# Altium project PCB_Project.PrjPcb (part 3 of 5)
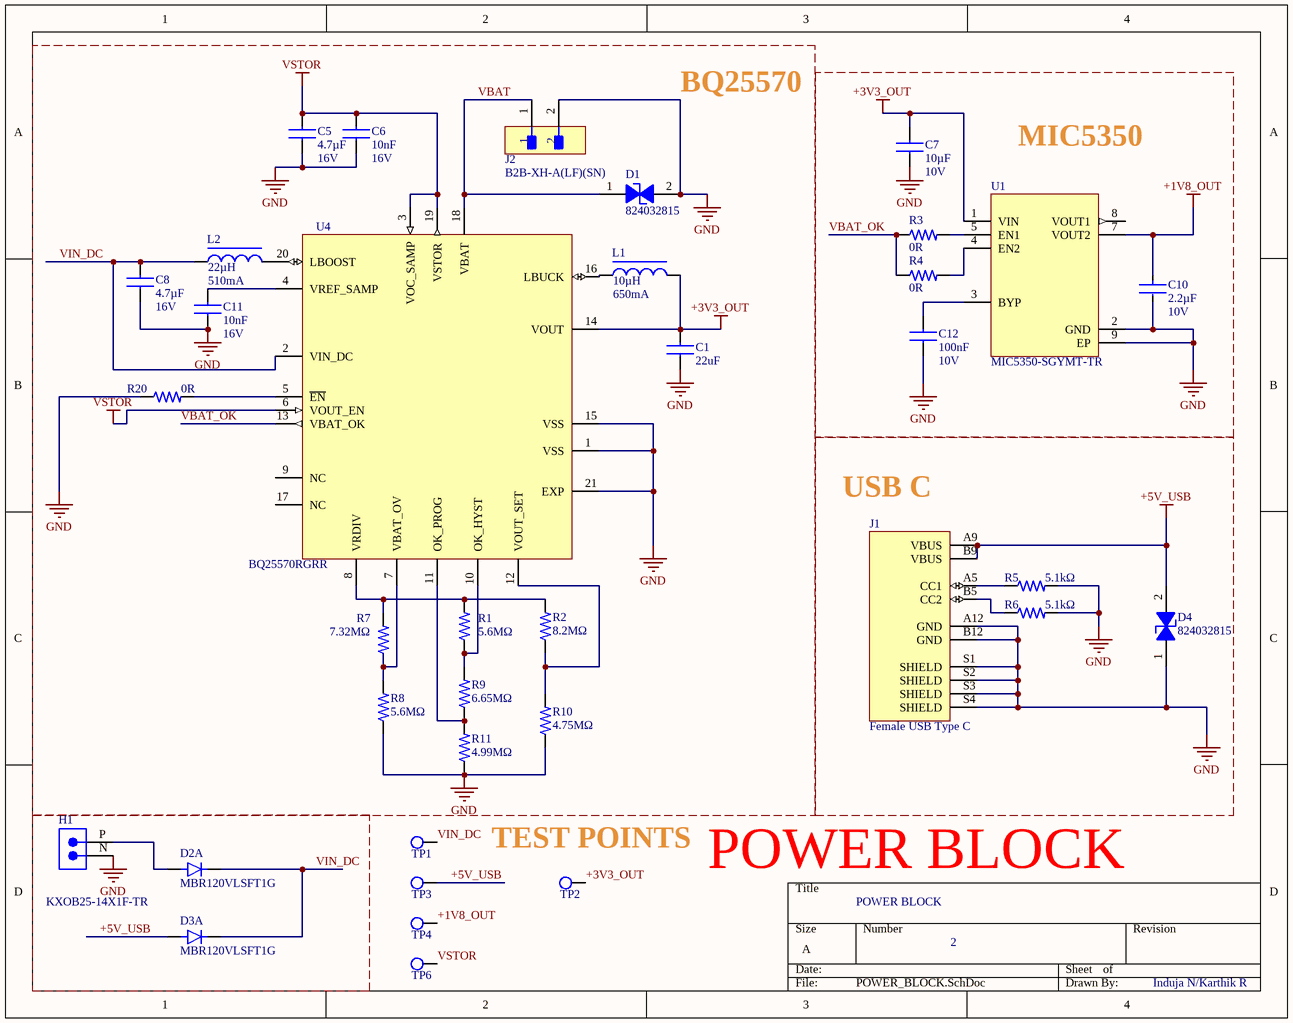
[diagram p8: POWER_BLOCK.SchDoc]

## Sheet POWER_BLOCK.SchDoc (continued)

### Library data of the parts (continued)
R11 = RES 4.99M 0603: Fixed Resistor, Metal Glaze/thick Film, 0.1W, 4990000ohm, 75V, 1% +/-Tol, 100ppm/Cel, Surface Mount, 0603; Manufacturer: Yageo; Manufacturer Part Number: RC0603FR-074M99L; Additional Feature: LASER TRIMMABLE; Power: 100mW; Rated Temperature: 70°C; Temperature Coefficient: 100ppm/°C; Package Height: 0.45mm; Package Length: 1.6mm; Package Width: 0.8mm; Supplier: Digikey; Supplier Part Number: 13-RC0603FR-074M99LDKR-ND; RoHS: Yes; Category: Chip SMD Resistors; Stock: 585; Pricing: 1=0.1, 10=0.019, 50=0.0112, 100=0.0093, 500=0.00622, 1000=0.00532 (USD); Mounting Technology: Surface Mount; Pins: 2; Package Shape: Rectangular; Case/Package: 0603; Terminal Finish: Nickel; Min Operating Temperature: -55°C; Max Operating Temperature: 155°C; Tolerance: 1%; JESD-609 Code: e3; Resistor Type: FIXED RESISTOR; Construction: Chip; Package Style: SMTMeter; Packaging: Tape and Reel; Technology: METAL GLAZE/THICK FILM; Termination: Wraparound; Working Voltage: 75V; Reach SVHC Compliant: Yes; RoHS Compliant: Yes; ComponentLink1URL: https://datasheet.ciiva.com:443/pdfs/VipMasterIC/IC/YAGO/YAGO-S-A0008145938/YAGO-S-A0008145938-1.pdf?src-supplier=IHS+Markit; ComponentLink1Description: https://datasheet.ciiva.com:443/pdfs/VipMasterIC/IC/YAGO/YAGO-S-A0008145938/YAGO-S-A0008145938-1.pdf?src-supplier=IHS+Markit; ComponentLink2URL: http://www.mouser.com/ds/2/447/RC0603-272842.pdf?src-supplier=Mouser; ComponentLink2Description: http://www.mouser.com/ds/2/447/RC0603-272842.pdf?src-supplier=Mouser; ComponentLink3URL: http://www.yageo.com/documents/recent/PYu-RC_Group_51_RoHS_L_9.pdf?src-supplier=Digikey; ComponentLink3Description: http://www.yageo.com/documents/recent/PYu-RC_Group_51_RoHS_L_9.pdf?src-supplier=Digikey; ComponentLink4URL: http://www.yageo.com/documents/recent/PYu-RC0603_51_RoHS_L_7.pdf?src-supplier=Future+Electronics; ComponentLink4Description: http://www.yageo.com/documents/recent/PYu-RC0603_51_RoHS_L_7.pdf?src-supplier=Future+Electronics; ComponentLink5URL: http://www.yageo.com/documents/recent/PYu-RC_Group_51_RoHS_L_2.pdf?src-supplier=Avnet; ComponentLink5Description: http://www.yageo.com/documents/recent/PYu-RC_Group_51_RoHS_L_2.pdf?src-supplier=Avnet; ComponentLink6URL: https://datasheet.octopart.com/RC0603FR-074M99L-Yageo-datasheet-164759695.pdf?src-supplier=Future+Electronics; ComponentLink6Description: https://datasheet.octopart.com/RC0603FR-074M99L-Yageo-datasheet-164759695.pdf?src-supplier=Future+Electronics; ComponentLink7URL: https://datasheet.octopart.com/RC0603FR-074M99L-Yageo-datasheet-148775077.pdf?src-supplier=TME; ComponentLink7Description: https://datasheet.octopart.com/RC0603FR-074M99L-Yageo-datasheet-148775077.pdf?src-supplier=TME; Supplier 1: DigiKey; Supplier Part Number 1: 13-RC0603FR-074M99LCT-ND
U1 = MIC5350-SGYMT-TR: Linear Voltage Regulator IC Positive Fixed 2 Output 300mA, 500mA 8-TMLFÂ® (2x2); MF: Microchip; SnapEDA_Link: https://www.snapeda.com/parts/MIC5350-SGYMT-TR/Microchip/view-part/?ref=snap; Package: UFDFN-8 Microchip; Value: *; MP: MIC5350-SGYMT-TR; Check_prices: https://www.snapeda.com/parts/MIC5350-SGYMT-TR/Microchip/view-part/?ref=eda; Supplier 1: DigiKey; Supplier Part Number 1: 576-3674-1-ND
U4 = BQ25570RGRR: Ultra Low power Harvester power Management IC with boost charger, and Nanopower Buck Converter; MF: Texas Instruments; Package: VQFN-20 Texas Instruments; Value: *; Purchase-URL: https://pricing.snapeda.com/search/part/BQ25570RGRR/?ref=eda; Availability: In Stock; MP: BQ25570RGRR; Check_prices: https://www.snapeda.com/parts/BQ25570RGRR/Texas+Instruments/view-part/?ref=eda; SnapEDA_Link: https://www.snapeda.com/parts/BQ25570RGRR/Texas+Instruments/view-part/?ref=snap; Price: None; Supplier 1: DigiKey; Supplier Part Number 1: 296-39934-1-ND

## Sheet HEART_RATE.SchDoc
size A4; Author: Induja N/Karthik R; SheetNumber: 3; SheetTotal: 7
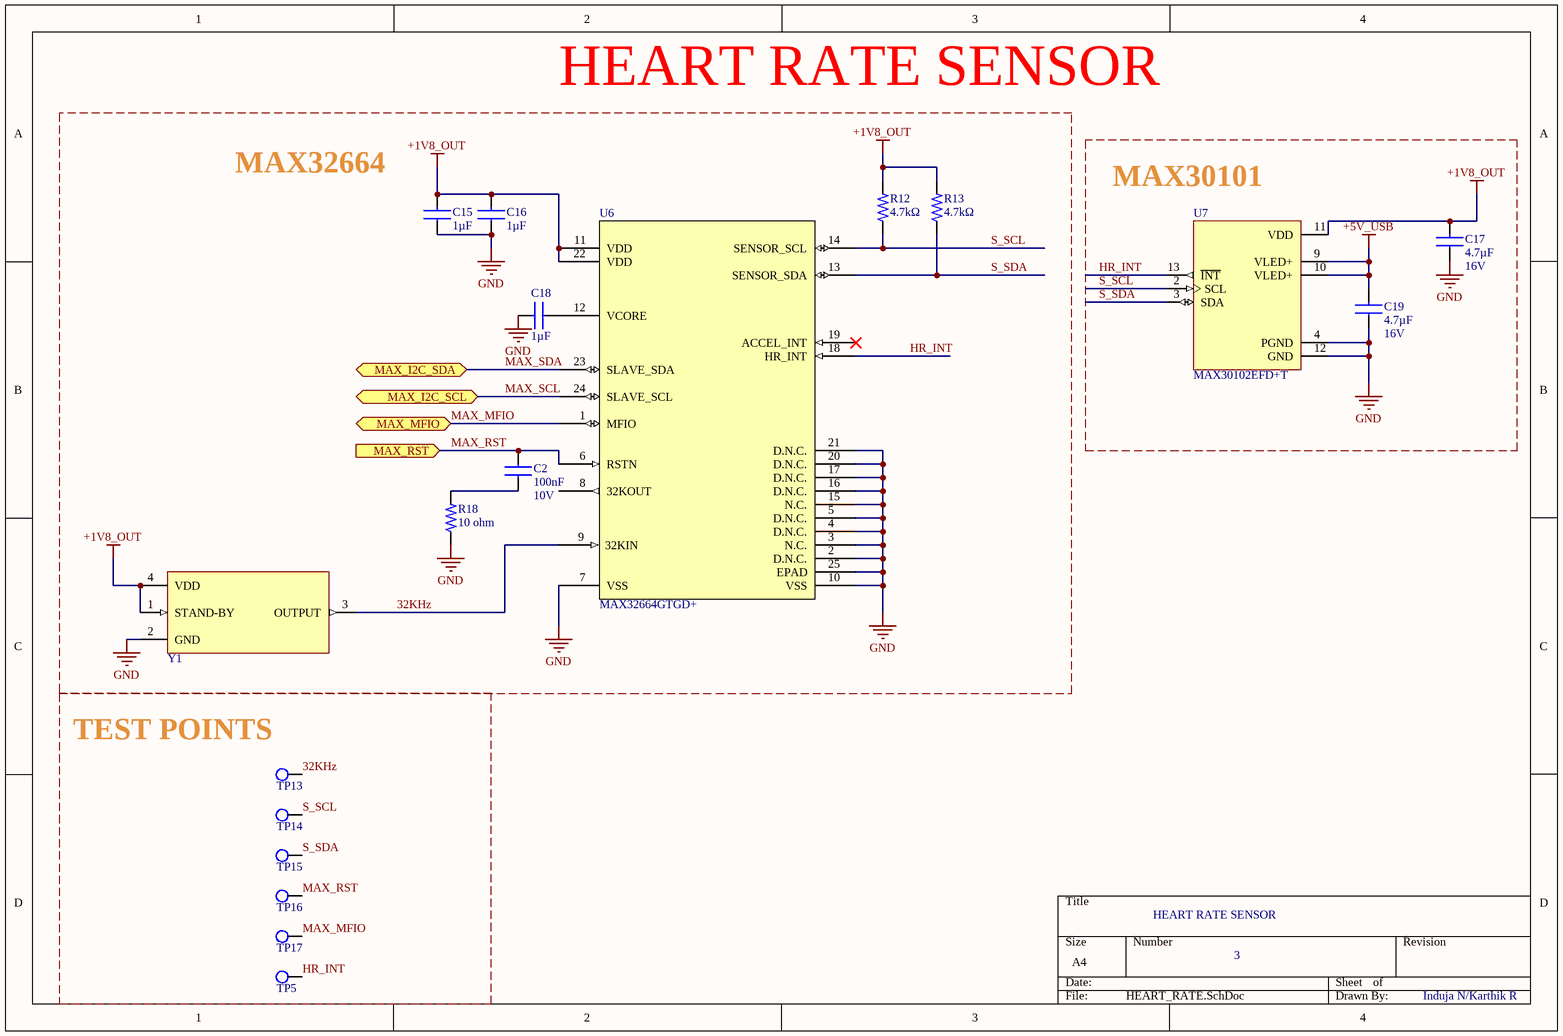
[diagram p2: HEART_RATE.SchDoc]

### Parts
C2  value 100nF  Voltage Rating (DC): 10V  [CAP_0603_1MM]  (hidden comment: CAP 0.1uF 0603)
C15  value 1µF  [Capacitor 0603]
C16  value 1µF  [Capacitor 0603]
C17  value 4.7µF  Voltage Rating (DC): 16V  [Capacitor 0603]  (hidden comment: GRM188Z71C475KE21D)
C18  value 1µF  [Capacitor 0603]
C19  value 4.7µF  Voltage Rating (DC): 16V  [Capacitor 0603]  (hidden comment: GRM188Z71C475KE21D)
R12  value 4.7kΩ  [RES_0603_1608X06]  (hidden comment: RES 4.7K 0603)
R13  value 4.7kΩ  [RES_0603_1608X06]  (hidden comment: RES 4.7K 0603)
R18  10 ohm  [RES_0603_1608X06]
TP5  Test Point  [Test Point]  (value not drawn)  (net tie, no BOM)
TP13  Test Point  [Test Point]  (value not drawn)  (net tie, no BOM)
TP14  Test Point  [Test Point]  (value not drawn)  (net tie, no BOM)
TP15  Test Point  [Test Point]  (value not drawn)  (net tie, no BOM)
TP16  Test Point  [Test Point]  (value not drawn)  (net tie, no BOM)
TP17  Test Point  [Test Point]  (value not drawn)  (net tie, no BOM)
U6  MAX32664GTGD+  [21-100264_T2433+2C_MXM]
U7  MAX30102EFD+T  [XDCR_MAX30101EFD+]
Y1  ECS-327MV-DM-TR  [OSC_ECS-327MV-DM-TR-4]  (value not drawn)

### Blocks framed on the sheet
HEART RATE SENSOR: C2 C15 C16 C18 R12 R13 R18 U6 Y1
MAX30101: C17 C19 U7
TEST POINTS: TP5 TP13-TP17

### Ports
MAX_I2C_SCL (bidir, see COMMUNICATION[3B]), MAX_I2C_SDA (bidir, see COMMUNICATION[3B]), MAX_MFIO (bidir, see EFR32BG13_INTERCONNECTS[3C]), MAX_RST (in, see EFR32BG13_INTERCONNECTS[3B])

### Nets
+1V8_OUT: C15.1 C16.1 C17.1 R12.2 R13.2 U6.11(VDD) U6.22(VDD) U7.11(VDD) Y1.1(STAND-BY) Y1.4(VDD)
+5V_USB: C19.1 U7.9(VLED+) U7.10(VLED+)
GND: C15.2 C16.2 C17.2 C18.2 C19.2 R18.1 U6.2(D.N.C.) U6.3(N.C.) U6.4(D.N.C.) U6.5(D.N.C.) U6.7(VSS) U6.10(VSS) U6.15(N.C.) U6.16(D.N.C.) U6.17(D.N.C.) U6.20(D.N.C.) U6.21(D.N.C.) U6.25(EPAD) U7.4(PGND) U7.12(GND) Y1.2(GND)
32KHz: TP13.1 U6.9(32KIN) Y1.3(OUTPUT)
HR_INT: TP5.1 U6.18(HR_INT) U7.13(~{INT})
MAX_MFIO: TP17.1 U6.1(MFIO) ; port MAX_MFIO
MAX_RST: C2.1 TP16.1 U6.6(RSTN) ; port MAX_RST
MAX_SCL: U6.24(SLAVE_SCL) ; port MAX_I2C_SCL
MAX_SDA: U6.23(SLAVE_SDA) ; port MAX_I2C_SDA
S_SCL: R12.1 TP14.1 U6.14(SENSOR_SCL) U7.2(SCL)
S_SDA: R13.1 TP15.1 U6.13(SENSOR_SDA) U7.3(SDA)
NetC2_2: C2.2 R18.2
NetC18_1: C18.1 U6.12(VCORE)

Not connected (* = marked no-connect by the designer): U6 8(32KOUT) 19(ACCEL_INT)*

### Notes on the sheet
- MAX32664
- HEART RATE SENSOR

### Library data of the parts
C2 = CAP 0.1uF 0603: 0603 0.1 uF 10 V ±10% Tolerance X7R SMT Multilayer Ceramic Chip Capacitor; Manufacturer: Vishay; Manufacturer Part Number: VJ0603Y104KXQCW1BC; Supplier: Newark; Supplier Part Number: 77AK2911; RoHS: Compliant; Category: Ceramic Capacitors; Stock: 20000; Pricing: 4000=0.028, 8000=0.026 (USD); Case/Package: 0603; Case Code (Imperial): 0603; Case Code (Metric): 1608; China RoHS: Compliant; Depth: 800µm; Dielectric: X7R; Dielectric Material: Ceramic; Height: 870µm; Lead Free: Lead Free; Length: 1.6mm; Lifecycle Status: Production; Max Operating Temperature: 125°C; Min Operating Temperature: -55°C; Mounting Technology: Surface Mount; Number of Terminals: 2; REACH SVHC: Yes; Schedule B: 8532240020, 8532240020|8532240020|8532240020|8532240020|8532240020; Termination: SMD/SMT; Tolerance: 10%; Width: 800µm; ComponentLink1URL: https://datasheet.octopart.com:443/VJ0603Y104KXQCW1BC-Vishay-datasheet-182138897.pdf?src-supplier=IHS; ComponentLink1Description: https://datasheet.octopart.com:443/VJ0603Y104KXQCW1BC-Vishay-datasheet-182138897.pdf?src-supplier=IHS; ComponentLink2URL: https://datasheet.octopart.com:443/VJ0603Y104KXQCW1BC-Vishay-datasheet-182137611.pdf?src-supplier=IHS; ComponentLink2Description: https://datasheet.octopart.com:443/VJ0603Y104KXQCW1BC-Vishay-datasheet-182137611.pdf?src-supplier=IHS; ComponentLink3URL: https://datasheet.octopart.com:443/VJ0603Y104KXQCW1BC-Vishay-datasheet-79783898.pdf?src-supplier=Future+Electronics; ComponentLink3Description: https://datasheet.octopart.com:443/VJ0603Y104KXQCW1BC-Vishay-datasheet-79783898.pdf?src-supplier=Future+Electronics; ComponentLink4URL: https://datasheet.octopart.com/VJ0603Y104KXQCW1BC-Vishay-datasheet-13530908.pdf; ComponentLink4Description: https://datasheet.octopart.com/VJ0603Y104KXQCW1BC-Vishay-datasheet-13530908.pdf; ComponentLink5URL: https://datasheet.octopart.com/VJ0603Y104KXQCW1BC-Vishay-datasheet-13436109.pdf; ComponentLink5Description: https://datasheet.octopart.com/VJ0603Y104KXQCW1BC-Vishay-datasheet-13436109.pdf; ComponentLink6URL: https://datasheet.octopart.com/VJ0603Y104KXQCW1BC-Vishay-datasheet-13168783.pdf; ComponentLink6Description: https://datasheet.octopart.com/VJ0603Y104KXQCW1BC-Vishay-datasheet-13168783.pdf; ComponentLink7URL: https://datasheet.octopart.com/VJ0603Y104KXQCW1BC-Vishay-datasheet-13134009.pdf; ComponentLink7Description: https://datasheet.octopart.com/VJ0603Y104KXQCW1BC-Vishay-datasheet-13134009.pdf; ComponentLink8URL: https://datasheet.octopart.com/VJ0603Y104KXQCW1BC-Vishay-datasheet-13055807.pdf; ComponentLink8Description: https://datasheet.octopart.com/VJ0603Y104KXQCW1BC-Vishay-datasheet-13055807.pdf; ComponentLink9URL: https://datasheet.octopart.com/VJ0603Y104KXQCW1BC-Vishay-datasheet-13029350.pdf; ComponentLink9Description: https://datasheet.octopart.com/VJ0603Y104KXQCW1BC-Vishay-datasheet-13029350.pdf; ComponentLink10URL: https://datasheet.octopart.com/VJ0603Y104KXQCW1BC-Vishay-datasheet-12584848.pdf; ComponentLink10Description: https://datasheet.octopart.com/VJ0603Y104KXQCW1BC-Vishay-datasheet-12584848.pdf; ComponentLink11URL: https://datasheet.octopart.com/VJ0603Y104KXQCW1BC-Vishay-datasheet-12543093.pdf; ComponentLink11Description: https://datasheet.octopart.com/VJ0603Y104KXQCW1BC-Vishay-datasheet-12543093.pdf; ComponentLink12URL: https://datasheet.octopart.com/VJ0603Y104KXQCW1BC-Vishay-datasheet-12532924.pdf; ComponentLink12Description: https://datasheet.octopart.com/VJ0603Y104KXQCW1BC-Vishay-datasheet-12532924.pdf; ComponentLink13URL: https://datasheet.octopart.com/VJ0603Y104KXQCW1BC-Vishay-datasheet-12519409.pdf; ComponentLink13Description: https://datasheet.octopart.com/VJ0603Y104KXQCW1BC-Vishay-datasheet-12519409.pdf; ComponentLink14URL: https://datasheet.octopart.com/VJ0603Y104KXQCW1BC-Vishay-datasheet-12509873.pdf; ComponentLink14Description: https://datasheet.octopart.com/VJ0603Y104KXQCW1BC-Vishay-datasheet-12509873.pdf; ComponentLink15URL: http://sigma.octopart.com:80/rohs_statement/Vishay-company-15.pdf?src-supplier=Compliance+Statements; ComponentLink15Description: http://sigma.octopart.com:80/rohs_statement/Vishay-company-15.pdf?src-supplier=Compliance+Statements; Supplier 1: DigiKey; Supplier Part Number 1: 720-1689-1-ND
C15 C16 C18 = CAP 1uF 0603: 16V 1uF X7R ±10% 0603 Multilayer Ceramic Capacitors MLCC - SMD/SMT ROHS; Manufacturer: Samsung Electro-Mechanics; Manufacturer Part Number: CL10B105KO8NNNC; Supplier: DigiKey; Supplier Part Number: 1276-1019-1-ND; RoHS: Compliant; Category: Ceramic Capacitors; Stock: 1501586; Pricing: 1=0.08, 10=0.011, 50=0.010, 100=0.0088 (USD); Case/Package: 0603; Case Code (Imperial): 0603; Case Code (Metric): 1608; China RoHS: Compliant; Depth: 800µm; Dielectric: X7R; Dielectric Material: Ceramic; Height: 800µm; Lead Free: Lead Free; Length: 1.6mm; Lifecycle Status: Production; Material: Ceramic; Max Operating Temperature: 125°C; Min Operating Temperature: -55°C; Mounting Technology: Surface Mount; Number of Terminals: 2; Radiation Hardening: No; REACH SVHC: Yes; Schedule B: 8532240020, 8532240020|8532240020, 8532240020|8532240020|8532240020, 8532240020|8532240020|8532240020|8532240020; Thickness: 889µm; Tolerance: 10%; Voltage: 16V; Voltage Rating: 16V; Voltage Rating (DC): 16V; Width: 800µm; ComponentLink1URL: https://datasheet.octopart.com:443/CL10B105KO8NNNC-Samsung-Electro-Mechanics-datasheet-137745070.pdf?src-supplier=IHS; ComponentLink1Description: https://datasheet.octopart.com:443/CL10B105KO8NNNC-Samsung-Electro-Mechanics-datasheet-137745070.pdf?src-supplier=IHS; ComponentLink2URL: https://datasheet.octopart.com/CL10B105KO8NNNC-Samsung-Electro-Mechanics-datasheet-8324245.pdf; ComponentLink2Description: https://datasheet.octopart.com/CL10B105KO8NNNC-Samsung-Electro-Mechanics-datasheet-8324245.pdf; ComponentLink3URL: https://datasheet.octopart.com/CL10B105KO8NNNC-Samsung-Electro-Mechanics-datasheet-97040617.pdf; ComponentLink3Description: https://datasheet.octopart.com/CL10B105KO8NNNC-Samsung-Electro-Mechanics-datasheet-97040617.pdf; ComponentLink4URL: https://datasheet.octopart.com/General-Multilayer-Ceramic-Capacitors-Samsung-datasheet-family-111.pdf; ComponentLink4Description: https://datasheet.octopart.com/General-Multilayer-Ceramic-Capacitors-Samsung-datasheet-family-111.pdf; ComponentLink5URL: https://datasheet.octopart.com:443/CL10B105KO8NNNC-Samsung-Electro-Mechanics-datasheet-116890984.pdf?src-supplier=Future+Electronics; ComponentLink5Description: https://datasheet.octopart.com:443/CL10B105KO8NNNC-Samsung-Electro-Mechanics-datasheet-116890984.pdf?src-supplier=Future+Electronics; ComponentLink6URL: https://datasheet.octopart.com:443/CL10B105KO8NNNC-Samsung-Electro-Mechanics-datasheet-81461852.pdf?src-supplier=Future+Electronics; ComponentLink6Description: https://datasheet.octopart.com:443/CL10B105KO8NNNC-Samsung-Electro-Mechanics-datasheet-81461852.pdf?src-supplier=Future+Electronics; ComponentLink7URL: https://datasheet.octopart.com:443/CL10B105KO8NNNC-Samsung-datasheet-42770397.pdf?src-supplier=Future+Electronics; ComponentLink7Description: https://datasheet.octopart.com:443/CL10B105KO8NNNC-Samsung-datasheet-42770397.pdf?src-supplier=Future+Electronics; ComponentLink8URL: https://datasheet.octopart.com:443/CL10B105KO8NNNC-Samsung-datasheet-26669023.pdf?src-supplier=Future+Electronics; ComponentLink8Description: https://datasheet.octopart.com:443/CL10B105KO8NNNC-Samsung-datasheet-26669023.pdf?src-supplier=Future+Electronics; ComponentLink9URL: https://datasheet.octopart.com:443/CL10B105KO8NNNC-Samsung-Electro-Mechanics-datasheet-149136799.pdf?src-supplier=Future+Electronics; ComponentLink9Description: https://datasheet.octopart.com:443/CL10B105KO8NNNC-Samsung-Electro-Mechanics-datasheet-149136799.pdf?src-supplier=Future+Electronics; ComponentLink10URL: https://datasheet.octopart.com:443/CL10B105KO8NNNC-Samsung-datasheet-151956584.pdf?src-supplier=SOS+electronic; ComponentLink10Description: https://datasheet.octopart.com:443/CL10B105KO8NNNC-Samsung-datasheet-151956584.pdf?src-supplier=SOS+electronic; ComponentLink11URL: https://datasheet.octopart.com:443/CL10B105KO8NNNC-Samsung-Electro-Mechanics-datasheet-11774093.pdf?src-supplier=Arrow+Electronics; ComponentLink11Description: https://datasheet.octopart.com:443/CL10B105KO8NNNC-Samsung-Electro-Mechanics-datasheet-11774093.pdf?src-supplier=Arrow+Electronics; ComponentLink12URL: https://datasheet.octopart.com:443/CL10B105KO8NNNC-Samsung-datasheet-59220082.pdf?src-supplier=TME; ComponentLink12Description: https://datasheet.octopart.com:443/CL10B105KO8NNNC-Samsung-datasheet-59220082.pdf?src-supplier=TME; ComponentLink13URL: http://sigma.octopart.com:80/rohs_certificate/General-Multilayer-Ceramic-Capacitors-Samsung-family-110.pdf?src-supplier=Compliance+Statements; ComponentLink13Description: http://sigma.octopart.com:80/rohs_certificate/General-Multilayer-Ceramic-Capacitors-Samsung-family-110.pdf?src-supplier=Compliance+Statements; ComponentLink14URL: http://sigma.octopart.com:80/rohs_statement/General-Multilayer-Ceramic-Capacitors-Samsung-family-132.pdf?src-supplier=Compliance+Statements; ComponentLink14Description: http://sigma.octopart.com:80/rohs_statement/General-Multilayer-Ceramic-Capacitors-Samsung-family-132.pdf?src-supplier=Compliance+Statements; ComponentLink15URL: http://sigma.octopart.com:80/reach_statement/General-Multilayer-Ceramic-Capacitors-Samsung-family-133.pdf?src-supplier=Compliance+Statements; ComponentLink15Description: http://sigma.octopart.com:80/reach_statement/General-Multilayer-Ceramic-Capacitors-Samsung-family-133.pdf?src-supplier=Compliance+Statements; Supplier 1: DigiKey; Supplier Part Number 1: 1276-1019-1-ND
C17 C19 = CAP 4.7uF 16V X7R: 16V 4.7uF X7R ±10% 0603 Multilayer Ceramic Capacitors MLCC - SMD/SMT ROHS; Manufacturer: Murata; Manufacturer Lifecycle Status: IN PRODUCTION; Supplier: Newark; Supplier Part Number: 64AJ4376; Manufacturer Part Number: GRM188Z71C475KE21D; RoHS: Compliant; Category: Ceramic Capacitors; Stock: 28269; Pricing: 10=0.105, 25=0.097, 50=0.089, 100=0.081, 250=0.078, 500=0.074, 1000=0.067 (USD); Case/Package: 0603; Dielectric Material: Ceramic; Height: 800µm; Length: 1.6mm; Lifecycle Status: Production; Material: Ceramic; Max Operating Temperature: 125°C; Min Operating Temperature: -55°C; Mounting Technology: Surface Mount; Number of Terminals: 2; REACH SVHC: Yes; Thickness: 800µm; Tolerance: 10%; Voltage Rating: 16V; Width: 800µm; ComponentLink1URL: https://datasheet.octopart.com:443/GRM188Z71C475KE21D-Murata-datasheet-141276020.pdf?src-supplier=Geoflip; ComponentLink1Description: https://datasheet.octopart.com:443/GRM188Z71C475KE21D-Murata-datasheet-141276020.pdf?src-supplier=Geoflip; ComponentLink2URL: https://datasheet.octopart.com:443/GRM188Z71C475KE21D-Murata-datasheet-165579666.pdf?src-supplier=TME; ComponentLink2Description: https://datasheet.octopart.com:443/GRM188Z71C475KE21D-Murata-datasheet-165579666.pdf?src-supplier=TME; ComponentLink3URL: https://datasheet.octopart.com:443/GRM188Z71C475KE21D-Murata-datasheet-140705917.pdf?src-supplier=Ciiva; ComponentLink3Description: https://datasheet.octopart.com:443/GRM188Z71C475KE21D-Murata-datasheet-140705917.pdf?src-supplier=Ciiva; ComponentLink4URL: https://datasheet.octopart.com:443/GRM188Z71C475KE21D-Murata-datasheet-138743435.pdf?src-supplier=Ciiva; ComponentLink4Description: https://datasheet.octopart.com:443/GRM188Z71C475KE21D-Murata-datasheet-138743435.pdf?src-supplier=Ciiva; ComponentLink5URL: http://sigma.octopart.com:80/reach_statement/Murata-company-16.pdf?src-supplier=Compliance+Statements; ComponentLink5Description: http://sigma.octopart.com:80/reach_statement/Murata-company-16.pdf?src-supplier=Compliance+Statements; Supplier 1: DigiKey; Supplier Part Number 1: 490-GRM188Z71C475KE21DCT-ND
R12 R13 = RES 4.7K 0603: Fixed Resistor, Metal Glaze/thick Film, 0.1W, 4700ohm, 75V, 1% +/-Tol, 100ppm/Cel, Surface Mount, 0603; Manufacturer: Yageo; Manufacturer Part Number: RC0603FR-074K7L; Additional Feature: LASER TRIMMABLE; Power: 100mW; Rated Temperature: 70°C; Temperature Coefficient: 100ppm/°C; Package Height: 0.45mm; Package Length: 1.6mm; Package Width: 0.8mm; Supplier: Digikey; Supplier Part Number: 311-4.70KHRCT-ND; RoHS: Yes; Category: Chip SMD Resistors; Stock: 2101497; Pricing: 1=0.1, 10=0.019, 50=0.0112, 100=0.0093, 500=0.00622, 1000=0.00532, 5000=0.00382, 10000=0.00335, 25000=0.00287, 35000=0.00278, 50000=0.00257, 125000=0.00232 (USD); Mounting Technology: Surface Mount; Pins: 2; Package Shape: Rectangular; Case/Package: 0603; Terminal Finish: Nickel; Min Operating Temperature: -55°C; Max Operating Temperature: 155°C; Tolerance: 1%; JESD-609 Code: e3; Resistor Type: FIXED RESISTOR; Construction: Chip; Package Style: SMTMeter; Packaging: Tape and Reel; Technology: METAL GLAZE/THICK FILM; Termination: Wraparound; Working Voltage: 75V; Reach SVHC Compliant: Yes; RoHS Compliant: Yes; ComponentLink1URL: https://datasheet.ciiva.com:443/pdfs/VipMasterIC/IC/YAGO/YAGO-S-A0008145938/YAGO-S-A0008145938-1.pdf?src-supplier=IHS+Markit; ComponentLink1Description: https://datasheet.ciiva.com:443/pdfs/VipMasterIC/IC/YAGO/YAGO-S-A0008145938/YAGO-S-A0008145938-1.pdf?src-supplier=IHS+Markit; ComponentLink2URL: https://datasheet.ciiva.com/46440/1868787-46440909.pdf?src-supplier=Element14; ComponentLink2Description: https://datasheet.ciiva.com/46440/1868787-46440909.pdf?src-supplier=Element14; ComponentLink3URL: https://datasheet.ciiva.com/7660/38590-7660794.pdf?src-supplier=Element14; ComponentLink3Description: https://datasheet.ciiva.com/7660/38590-7660794.pdf?src-supplier=Element14; ComponentLink4URL: https://datasheet.ciiva.com/7746/1868787-7746365.pdf?src-supplier=Element14; ComponentLink4Description: https://datasheet.ciiva.com/7746/1868787-7746365.pdf?src-supplier=Element14; ComponentLink5URL: https://datasheet.ciiva.com/7746/1738695-7746366.pdf?src-supplier=Element14; ComponentLink5Description: https://datasheet.ciiva.com/7746/1738695-7746366.pdf?src-supplier=Element14; ComponentLink6URL: https://datasheet.ciiva.com/22747/443971-22747528.pdf?src-supplier=Element14; ComponentLink6Description: https://datasheet.ciiva.com/22747/443971-22747528.pdf?src-supplier=Element14; Supplier 1: DigiKey; Supplier Part Number 1: 311-4.70KHRDKR-ND
R18 = RES 10 ohm: 10 Ohm CMP-2000-03846-1; Part Number: CRCW060310R0FKEAHP; Manufacturer: Vishay Dale; Supplier 1: DigiKey; Supplier Part Number 1: 541-10.0SCT-ND
U6 = MAX32664GTGD+: Ultra-Low Power Biometric Sensor Hub; Manufacturer_Name: Analog Devices Inc; Copyright: Copyright (C) 2025 Ultra Librarian. All rights reserved.; Manufacturer_Part_Number: MAX32664GTGD+; RefDes: RefDes; Type: Type; Supplier 1: DigiKey; Supplier Part Number 1: 505-MAX32664GTGD+-ND
U7 = MAX30102EFD+T: SENSOR - OXIMETER/HEART RATE I2C; Manufacturer: KEMET; Manufacturer Part Number: C0603C159C5GACTU; MF: Maxim Integrated Products; Dielectric: C0G; Dielectric Material: Ceramic; Dissipation Factor: 0.1%; Temperature Coefficient: 30ppm/°C; Tolerance: 5%; Voltage: 50V; Digi-Key_Part_Number: MAX30102EFD+TTR-ND; Check_prices: https://www.snapeda.com/parts/MAX30102EFD+T/Maxim+Integrated/view-part/?ref=eda; MP: MAX30102EFD+T; Package: None; SnapEDA_Link: https://www.snapeda.com/parts/MAX30102EFD+T/Maxim+Integrated/view-part/?ref=snap; Value: *; Purchase-URL: https://pricing.snapeda.com/search/part/MAX30102EFD+T/?ref=eda; Supplier: Newark; Supplier Part Number: 76Y2914; RoHS: Compliant; Category: Ceramic Capacitors; Stock: 56315; Pricing: 1=0.133, 10=0.048, 25=0.042, 50=0.035, 100=0.029, 250=0.026, 500=0.023 (USD); Case/Package: 0603; Case Code (Imperial): 0603; Case Code (Metric): 1608; China RoHS: Compliant; Depth: 800µm; Height: 800µm; Lead Free: Lead Free; Lead Pitch: 700µm; Length: 1.6mm; Lifecycle Status: Production; Material: Ceramic; Max Operating Temperature: 125°C; Min Operating Temperature: -55°C; Mounting Technology: Surface Mount; Pins: 2; Number of Terminals: 2; Packaging: Cut Tape; REACH SVHC: Yes; Schedule B: 8532240020, 8532240020|8532240020|8532240020|8532240020|8532240020; Termination: SMD/SMT; Thickness: 863.6µm; Voltage Rating: 50V; Voltage Rating (DC): 50V; Width: 800µm; ComponentLink1URL: https://datasheet.octopart.com:443/C0603C159C5GACTU-KEMET-datasheet-178132257.pdf?src-supplier=IHS; ComponentLink1Description: https://datasheet.octopart.com:443/C0603C159C5GACTU-KEMET-datasheet-178132257.pdf?src-supplier=IHS; ComponentLink2URL: https://datasheet.octopart.com:443/C0603C159C5GAC7867-KEMET-datasheet-10540709.pdf?src-supplier=IHS; ComponentLink2Description: https://datasheet.octopart.com:443/C0603C159C5GAC7867-KEMET-datasheet-10540709.pdf?src-supplier=IHS; ComponentLink3URL: https://datasheet.octopart.com:443/C0603C159C5GACTU-KEMET-datasheet-137357764.pdf?src-supplier=Upverter; ComponentLink3Description: https://datasheet.octopart.com:443/C0603C159C5GACTU-KEMET-datasheet-137357764.pdf?src-supplier=Upverter; ComponentLink4URL: https://datasheet.octopart.com:443/C0603C159C5GACTU-KEMET-datasheet-68331921.pdf?src-supplier=TME; ComponentLink4Description: https://datasheet.octopart.com:443/C0603C159C5GACTU-KEMET-datasheet-68331921.pdf?src-supplier=TME; ComponentLink5URL: https://datasheet.octopart.com:443/C0603C159C5GACTU-KEMET-datasheet-137149553.pdf?src-supplier=TME; ComponentLink5Description: https://datasheet.octopart.com:443/C0603C159C5GACTU-KEMET-datasheet-137149553.pdf?src-supplier=TME; ComponentLink6URL: https://datasheet.octopart.com:443/C0603C159C5GACTU-KEMET-datasheet-149521895.pdf?src-supplier=Farnell; ComponentLink6Description: https://datasheet.octopart.com:443/C0603C159C5GACTU-KEMET-datasheet-149521895.pdf?src-supplier=Farnell; ComponentLink7URL: https://datasheet.octopart.com:443/C0603C159C5GACTU-KEMET-datasheet-100448650.pdf?src-supplier=Farnell; ComponentLink7Description: https://datasheet.octopart.com:443/C0603C159C5GACTU-KEMET-datasheet-100448650.pdf?src-supplier=Farnell; ComponentLink8URL: https://datasheet.octopart.com:443/C0603C159C5GACTU-KEMET-datasheet-176289432.pdf?src-supplier=element14+APAC; ComponentLink8Description: https://datasheet.octopart.com:443/C0603C159C5GACTU-KEMET-datasheet-176289432.pdf?src-supplier=element14+APAC; ComponentLink9URL: https://datasheet.octopart.com:443/C0603C159C5GACTU-Kemet-datasheet-66160328.pdf?src-supplier=element14+APAC; ComponentLink9Description: https://datasheet.octopart.com:443/C0603C159C5GACTU-Kemet-datasheet-66160328.pdf?src-supplier=element14+APAC; ComponentLink10URL: https://datasheet.octopart.com:443/C0603C159C5GACTU-Kemet-datasheet-62058882.pdf?src-supplier=element14+APAC; ComponentLink10Description: https://datasheet.octopart.com:443/C0603C159C5GACTU-Kemet-datasheet-62058882.pdf?src-supplier=element14+APAC; ComponentLink11URL: https://datasheet.octopart.com:443/C0603C159C5GACTU-KEMET-datasheet-81638365.pdf?src-supplier=element14+APAC; ComponentLink11Description: https://datasheet.octopart.com:443/C0603C159C5GACTU-KEMET-datasheet-81638365.pdf?src-supplier=element14+APAC; ComponentLink12URL: https://datasheet.octopart.com:443/C0603C159C5GACTU-KEMET-datasheet-157246123.pdf?src-supplier=Electro+Sonic; ComponentLink12Description: https://datasheet.octopart.com:443/C0603C159C5GACTU-KEMET-datasheet-157246123.pdf?src-supplier=Electro+Sonic; ComponentLink13URL: https://datasheet.octopart.com:443/C0603C159C5GACTU-KEMET-datasheet-41232428.pdf?src-supplier=Electro+Sonic; ComponentLink13Description: https://datasheet.octopart.com:443/C0603C159C5GACTU-KEMET-datasheet-41232428.pdf?src-supplier=Electro+Sonic; ComponentLink14URL: https://datasheet.octopart.com/C0603C159C5GACTU-KEMET-datasheet-84169754.pdf; ComponentLink14Description: https://datasheet.octopart.com/C0603C159C5GACTU-KEMET-datasheet-84169754.pdf; ComponentLink15URL: https://datasheet.octopart.com:443/C0603C159C5GACTU-Kemet-datasheet-11574563.pdf?src-supplier=Arrow+Electronics; ComponentLink15Description: https://datasheet.octopart.com:443/C0603C159C5GACTU-Kemet-datasheet-11574563.pdf?src-supplier=Arrow+Electronics; ComponentLink16URL: https://datasheet.octopart.com:443/C0603C159C5GACTU-Kemet-datasheet-5314449.pdf?src-supplier=Newark; ComponentLink16Description: https://datasheet.octopart.com:443/C0603C159C5GACTU-Kemet-datasheet-5314449.pdf?src-supplier=Newark; ComponentLink17URL: https://datasheet.octopart.com:443/C0603C159C5GACTU-Kemet-datasheet-10282724.pdf?src-supplier=Newark; ComponentLink17Description: https://datasheet.octopart.com:443/C0603C159C5GACTU-Kemet-datasheet-10282724.pdf?src-supplier=Newark; ComponentLink18URL: https://datasheet.octopart.com:443/C0603C159C5GAC7867-KEMET-datasheet-164857143.pdf?src-supplier=Burklin+Elektronik; ComponentLink18Description: https://datasheet.octopart.com:443/C0603C159C5GAC7867-KEMET-datasheet-164857143.pdf?src-supplier=Burklin+Elektronik; ComponentLink19URL: https://datasheet.octopart.com:443/C0603C159C5GAC-TU-Kemet-datasheet-8749474.pdf?src-supplier=Jameco; ComponentLink19Description: https://datasheet.octopart.com:443/C0603C159C5GAC-TU-Kemet-datasheet-8749474.pdf?src-supplier=Jameco; ComponentLink20URL: https://datasheet.octopart.com:443/C0603C159C5GACTU-Kemet-datasheet-464.pdf?src-supplier=RS+(Formerly+Allied+Electronics); ComponentLink20Description: https://datasheet.octopart.com:443/C0603C159C5GACTU-Kemet-datasheet-464.pdf?src-supplier=RS+(Formerly+Allied+Electronics); Supplier 1: DigiKey; Supplier Part Number 1: MAX30102EFD+TCT-ND
Y1 = 32.768 kHz: 32.768 kHz XO (Standard) CMOS Oscillator Enable/Disable 4-SMD, No Lead; MF: ECS Inc.; Purchase-URL: https://pricing.snapeda.com/search/part/ECS-327MV-DM-TR/?ref=eda; SnapEDA_Link: https://www.snapeda.com/parts/ECS-327MV-DM-TR/ECS+Inc./view-part/?ref=snap; Value: *; MP: ECS-327MV-DM-TR; Package: None; Check_prices: https://www.snapeda.com/parts/ECS-327MV-DM-TR/ECS+Inc./view-part/?ref=eda; Digi-Key_Part_Number: 50-ECS-327MV-DM-TR-ND

## Sheet LCD.SchDoc
size A4; Author: Induja N/Karthik R; SheetNumber: 4; SheetTotal: 7
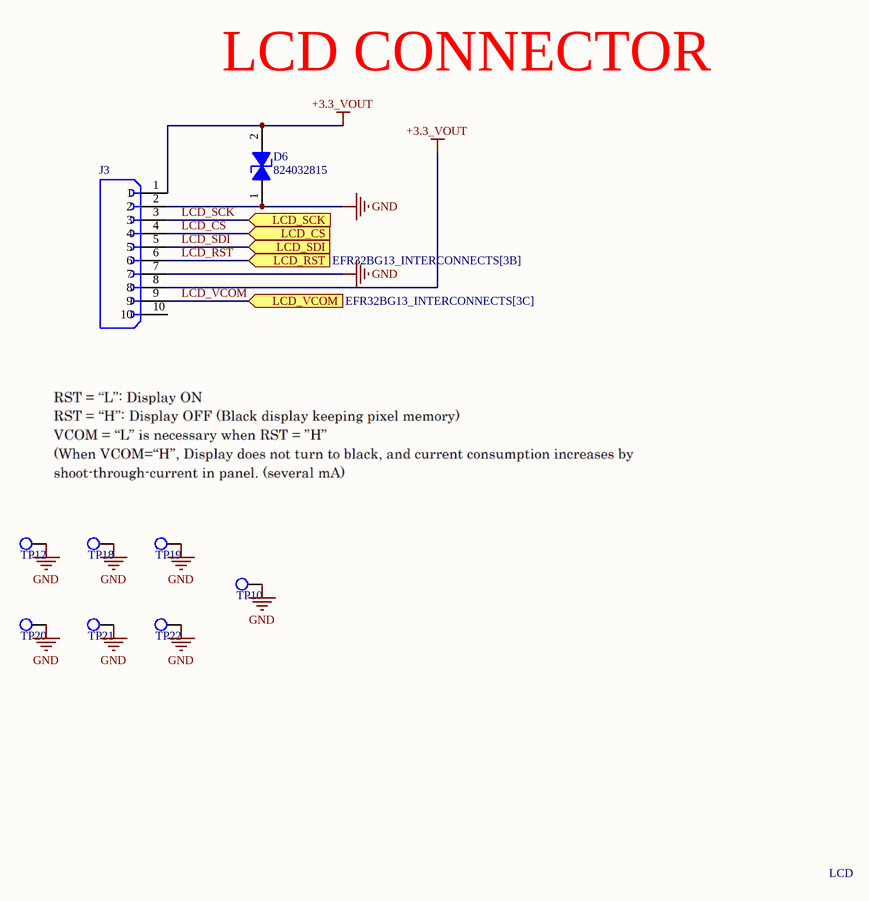
[diagram p3: LCD.SchDoc]

### Parts
D6  824032815  [WE-TVS_DFN1610-2L]
J3  (no value)  [HRS_TF13BA-10S-0.4SH(800)]
TP10  (no value)  [Test Point]  (net tie, no BOM)
TP12  (no value)  [Test Point]  (net tie, no BOM)
TP18  (no value)  [Test Point]  (net tie, no BOM)
TP19  (no value)  [Test Point]  (net tie, no BOM)
TP20  (no value)  [Test Point]  (net tie, no BOM)
TP21  (no value)  [Test Point]  (net tie, no BOM)
TP22  (no value)  [Test Point]  (net tie, no BOM)

### Ports
LCD_CS (in, see EFR32BG13_INTERCONNECTS[3B]), LCD_RST (in, see EFR32BG13_INTERCONNECTS[3B]), LCD_SCK (in, see EFR32BG13_INTERCONNECTS[3B]), LCD_SDI (in, see EFR32BG13_INTERCONNECTS[3B]), LCD_VCOM (in, see EFR32BG13_INTERCONNECTS[3C])

### Nets
+3.3_VOUT: D6.2(GND) J3.1 J3.8
GND: D6.1(I/O_1) J3.2 J3.7 TP10.1 TP12.1 TP18.1 TP19.1 TP20.1 TP21.1 TP22.1
LCD_CS: J3.4 ; port LCD_CS
LCD_RST: J3.6 ; port LCD_RST
LCD_SCK: J3.3 ; port LCD_SCK
LCD_SDI: J3.5 ; port LCD_SDI
LCD_VCOM: J3.9 ; port LCD_VCOM

Not connected (* = marked no-connect by the designer): J3 10

### Notes on the sheet
- LCD CONNECTOR
- LCD

### Library data of the parts
D6 = TVS Diode ESD Protection: 824032815 Tvs Diode, Bidir, 5V, Dfn1610 Rohs Compliant: Yes |Wurth Elektronik 824032815; NexarPartId: 133963841; Min Operating Temperature: -55°C; Width: 1mm; Length: 1.6mm; RoHS: Compliant; Max Operating Temperature: 85°C; Height: 500µm; Supplier 1: DigiKey; Supplier Part Number 1: 732-824032815CT-ND
J3 = TF13BA-10S-0.4SH(800): MP: TF13BA-10S-0.4SH(800); Value: *; Availability: Unavailable; Package: None; Price: None
TP10 TP12 TP18-TP22 = Test Point

## Sheet EFR32G13_POWER_RESET.SchDoc
size A4; Author: Induja N/Karthik R; SheetNumber: 5; SheetTotal: 7
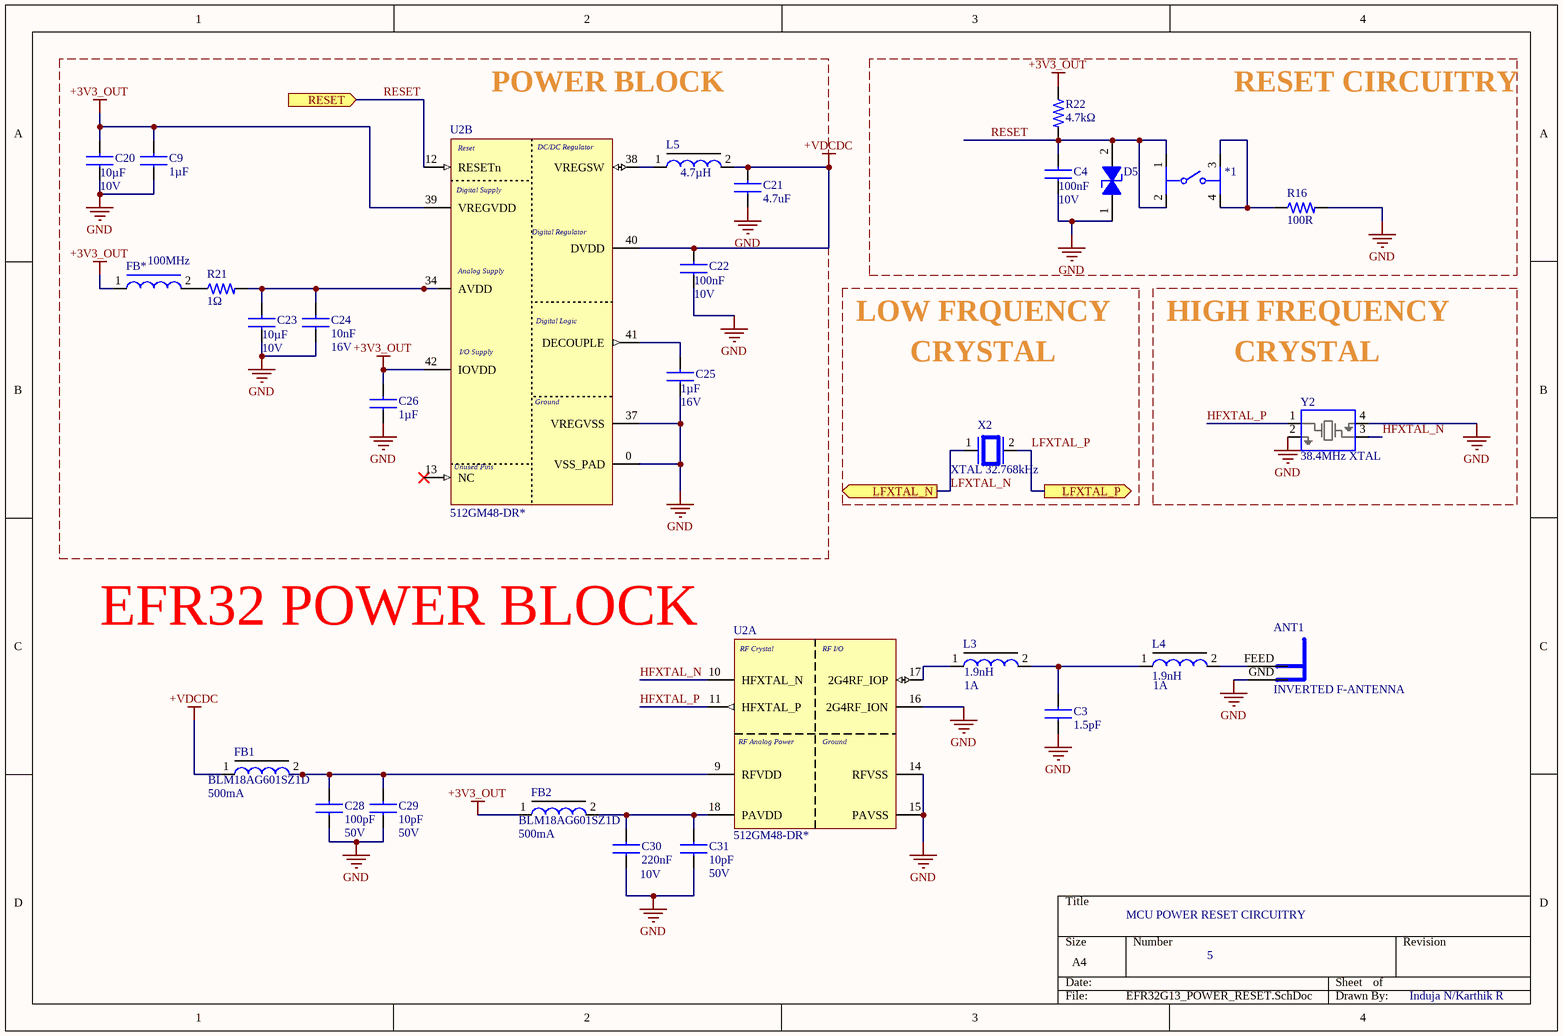
[diagram p4: EFR32G13_POWER_RESET.SchDoc]

### Parts
*1  (no value)  [SWITCH]
ANT1  INVERTED F-ANTENNA  [F_ANTENNA]  (net tie, no BOM)
C3  value 1.5pF  [Capacitor 0402]  (hidden comment: CAP 1.5pF 50V 0402)
C4  value 100nF  Voltage Rating (DC): 10V  [CAP_0603_1MM]  (hidden comment: CAP 0.1uF 0603)
C9  value 1µF  [Capacitor 0603]  (hidden comment: CAP 1uF 0603)
C20  value 10µF  Voltage Rating: 10V  [CAP_0603_1MM]  (hidden comment: CAP 10uF 0603)
C21  value 4.7uF  [CAPC1608X90N]  (hidden comment: CAP 4.7uF 16V 0603)
C22  value 100nF  Voltage Rating (DC): 10V  [CAP_0603_1MM]  (hidden comment: CAP 0.1uF 0603)
C23  value 10µF  Voltage Rating: 10V  [CAP_0603_1MM]  (hidden comment: CAP 10uF 0603)
C24  value 10nF  Voltage Rating (DC): 16V  [Capacitor 0603]  (hidden comment: CAP 10nF 0603)
C25  value 1µF  Voltage Rating (DC): 16V  [Capacitor 0603]  (hidden comment: CAP 1uF 0603)
C26  value 1µF  [Capacitor 0603]  (hidden comment: CAP 1uF 0603)
C28  value 100pF  Voltage Rating (DC): 50V  [CAP_0603_1MM]  (hidden comment: CAP 100pF 0603)
C29  value 10pF  Rated DC Voltage (URdc): 50V  [Capacitor 0603]  (hidden comment: CAP 10pF 50V 0603)
C30  value 220nF  Voltage Rating: 10V  [Capacitor 0603]  (hidden comment: CAP 220nF 10V 0603)
C31  value 10pF  Rated DC Voltage (URdc): 50V  [Capacitor 0603]  (hidden comment: CAP 10pF 50V 0603)
D5  824032815  [WE-TVS_DFN1610-2L]  (value not drawn)
FB1  BLM18AG601SZ1D  Max Current Rating: 500mA  [Ferrite 0603]
FB2  BLM18AG601SZ1D  Max Current Rating: 500mA  [Ferrite 0603]
FB*  Clock Frequency: 100MHz  [FP-BLM21-0_2-t0_85-e0_5-IPC_A]  (hidden comment: BLM21BD102SN1D)
L3  value 1.9nH  Current Rating: 1A  [Ferrite 0402]  (hidden comment: IND 1.9nH)
L4  value 1.9nH  Current Rating: 1A  [Ferrite 0402]  (hidden comment: IND 1.9nH)
L5  value 4.7µH  [Capacitor 0603]
R16  value 100R  [RES_0603_1608X06]
R21  value 1Ω  [RES_0603_1608X06]  (hidden comment: RES 1Ohm 0603)
R22  value 4.7kΩ  [RES_0603_1608X06]
U2  512GM48-DR*  [QFN_48_7x7]  (parts A,B of 3)
X2  XTAL 32.768kHz  [XTAL_32.768KHZ-T]
Y2  38.4MHz XTAL  [XTAL 38.4MHz]

### Blocks framed on the sheet
POWER BLOCK: C9 C20-C26 FB* L5 R21 U2
RESET CIRCUITRY: *1 C4 D5 R16 R22

### Ports
LFXTAL_N (out, see EFR32BG13_INTERCONNECTS[3B]), LFXTAL_P (out, see EFR32BG13_INTERCONNECTS[3B]), RESET (in, see COMMUNICATION[1C])

### Nets
+3V3_OUT: C9.1 C20.1 C26.1 FB2.1 FB*.1 R22.1 U2.39(VREGVDD) U2.42(IOVDD)
+VDCDC: C21.1 C22.1 FB1.1 L5.2 U2.40(DVDD)
GND: ANT1.GND C3.2 C4.2 C9.2 C20.2 C21.2 C22.2 C23.2 C24.2 C25.2 C26.2 C28.2 C29.2 C30.2 C31.2 D5.1(I/O_1) R16.2 U2.0(VSS_PAD) U2.14(RFVSS) U2.15(PAVSS) U2.16(2G4RF_ION) U2.37(VREGVSS) Y2.2 Y2.4
HFXTAL_N: U2.10(HFXTAL_N) Y2.3
HFXTAL_P: U2.11(HFXTAL_P) Y2.1
LFXTAL_N: X2.1 ; port LFXTAL_N
LFXTAL_P: X2.2 ; port LFXTAL_P
RESET: *1.1 *1.2 C4.1 D5.2(GND) R22.2 U2.12(RESETn) ; port RESET
Net*1_3: *1.3 *1.4 R16.1
NetANT1_FEED: ANT1.FEED L4.2
NetC3_1: C3.1 L3.2 L4.1
NetC23_1: C23.1 C24.1 R21.2 U2.34(AVDD)
NetC25_1: C25.1 U2.41(DECOUPLE)
NetC28_1: C28.1 C29.1 FB1.2 U2.9(RFVDD)
NetC30_1: C30.1 C31.1 FB2.2 U2.18(PAVDD)
NetFB*_2: FB*.2 R21.1
NetL3_1: L3.1 U2.17(2G4RF_IOP)
NetL5_1: L5.1 U2.38(VREGSW)

Not connected (* = marked no-connect by the designer): U2 13(NC)*

### Notes on the sheet
- LOW FRQUENCY
- CRYSTAL
- HIGH FREQUENCY
- EFR32 POWER BLOCK
- MCU POWER RESET CIRCUITRY
- (in symbol EFR32BG13P732F512GM48-DR, part A) RF Crystal; RF I/O; RF Analog Power; Ground
- (in symbol EFR32BG13P732F512GM48-DR, part B) Reset; DC/DC Regulator; Digital Supply; Digital Regulator; Analog Supply; Digital Logic; I/O Supply; Ground; Unused Pins